# Altium schematic sheet 17 Revision History.SchDoc
size A2; DocumentNumber: 17; SheetNumber: 17; SheetTotal: 17; VersionControl_RevNumber: DNP; IsUserConfigurable: DNP
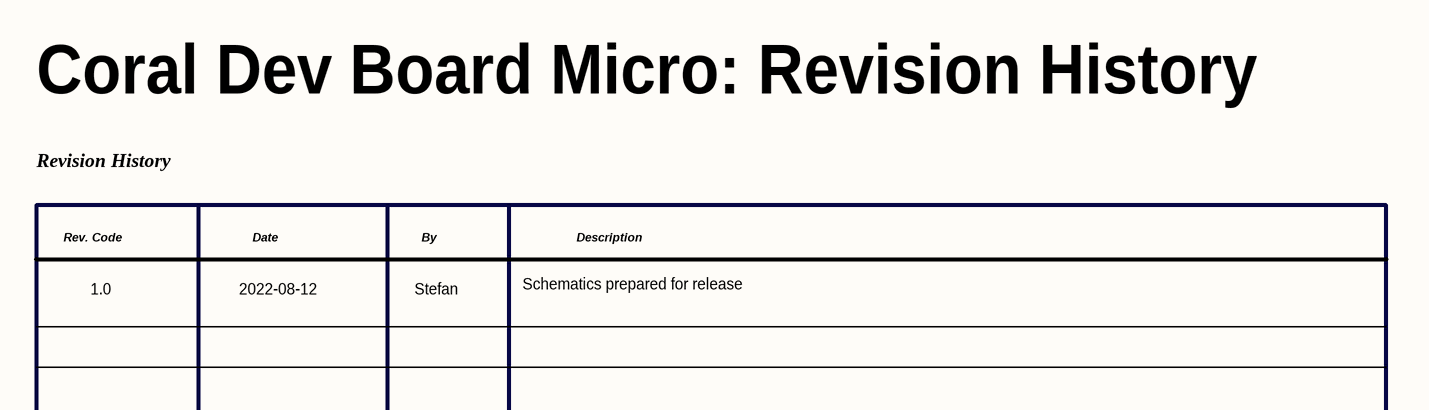
[diagram p0: 17 Revision History.SchDoc, left]
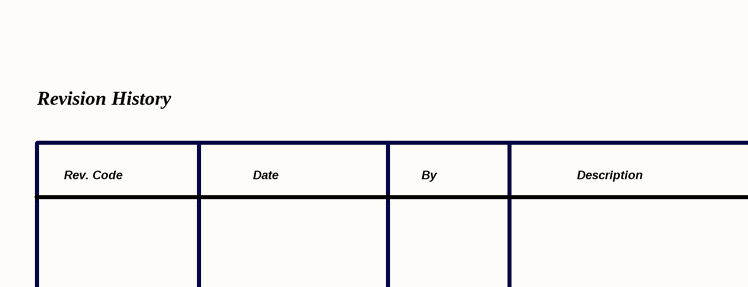
[diagram p1: 17 Revision History.SchDoc, right]

## Notes on the sheet
- Coral Dev Board Micro: Revision History
- Revision History
- Rev. Code
- Date
- By
- Description
- 1.0
- 2022-08-12
- Stefan
- Schematics prepared for release
- Project:
- Proprietary and Confidential
- Engineer:
- Date:
- File:
- Revision:
- Sheet
- of